# Altium schematic sheet Hall_measurement.SchDoc
size A2
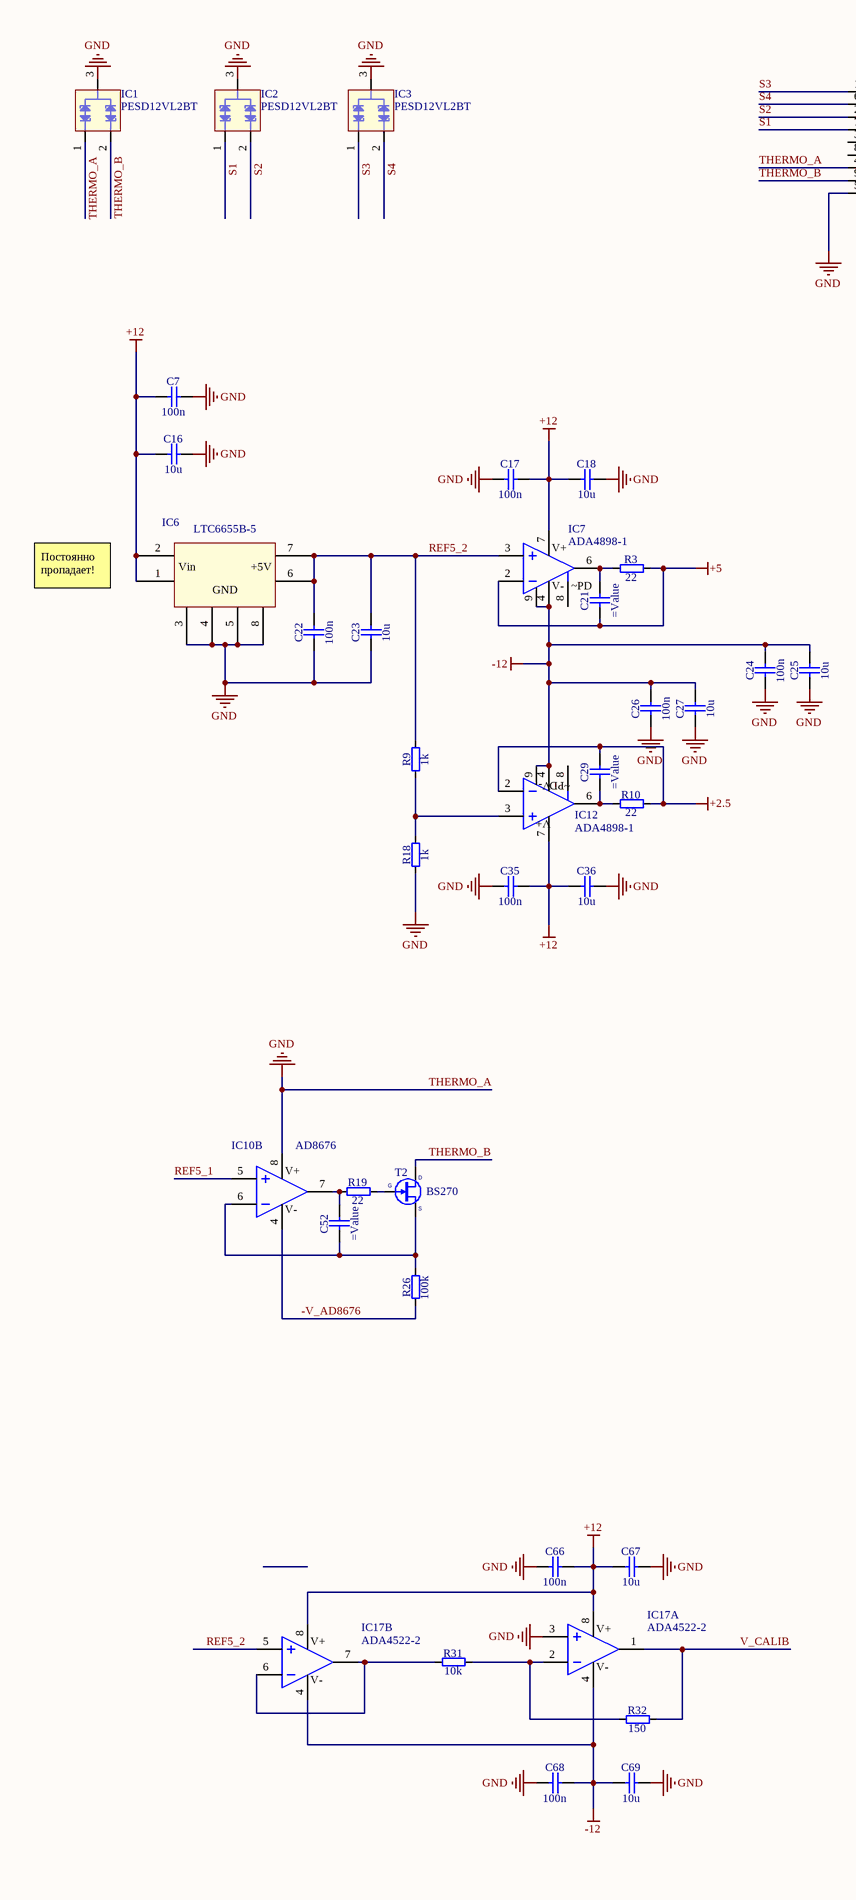
[diagram p0: Hall_measurement.SchDoc, left]
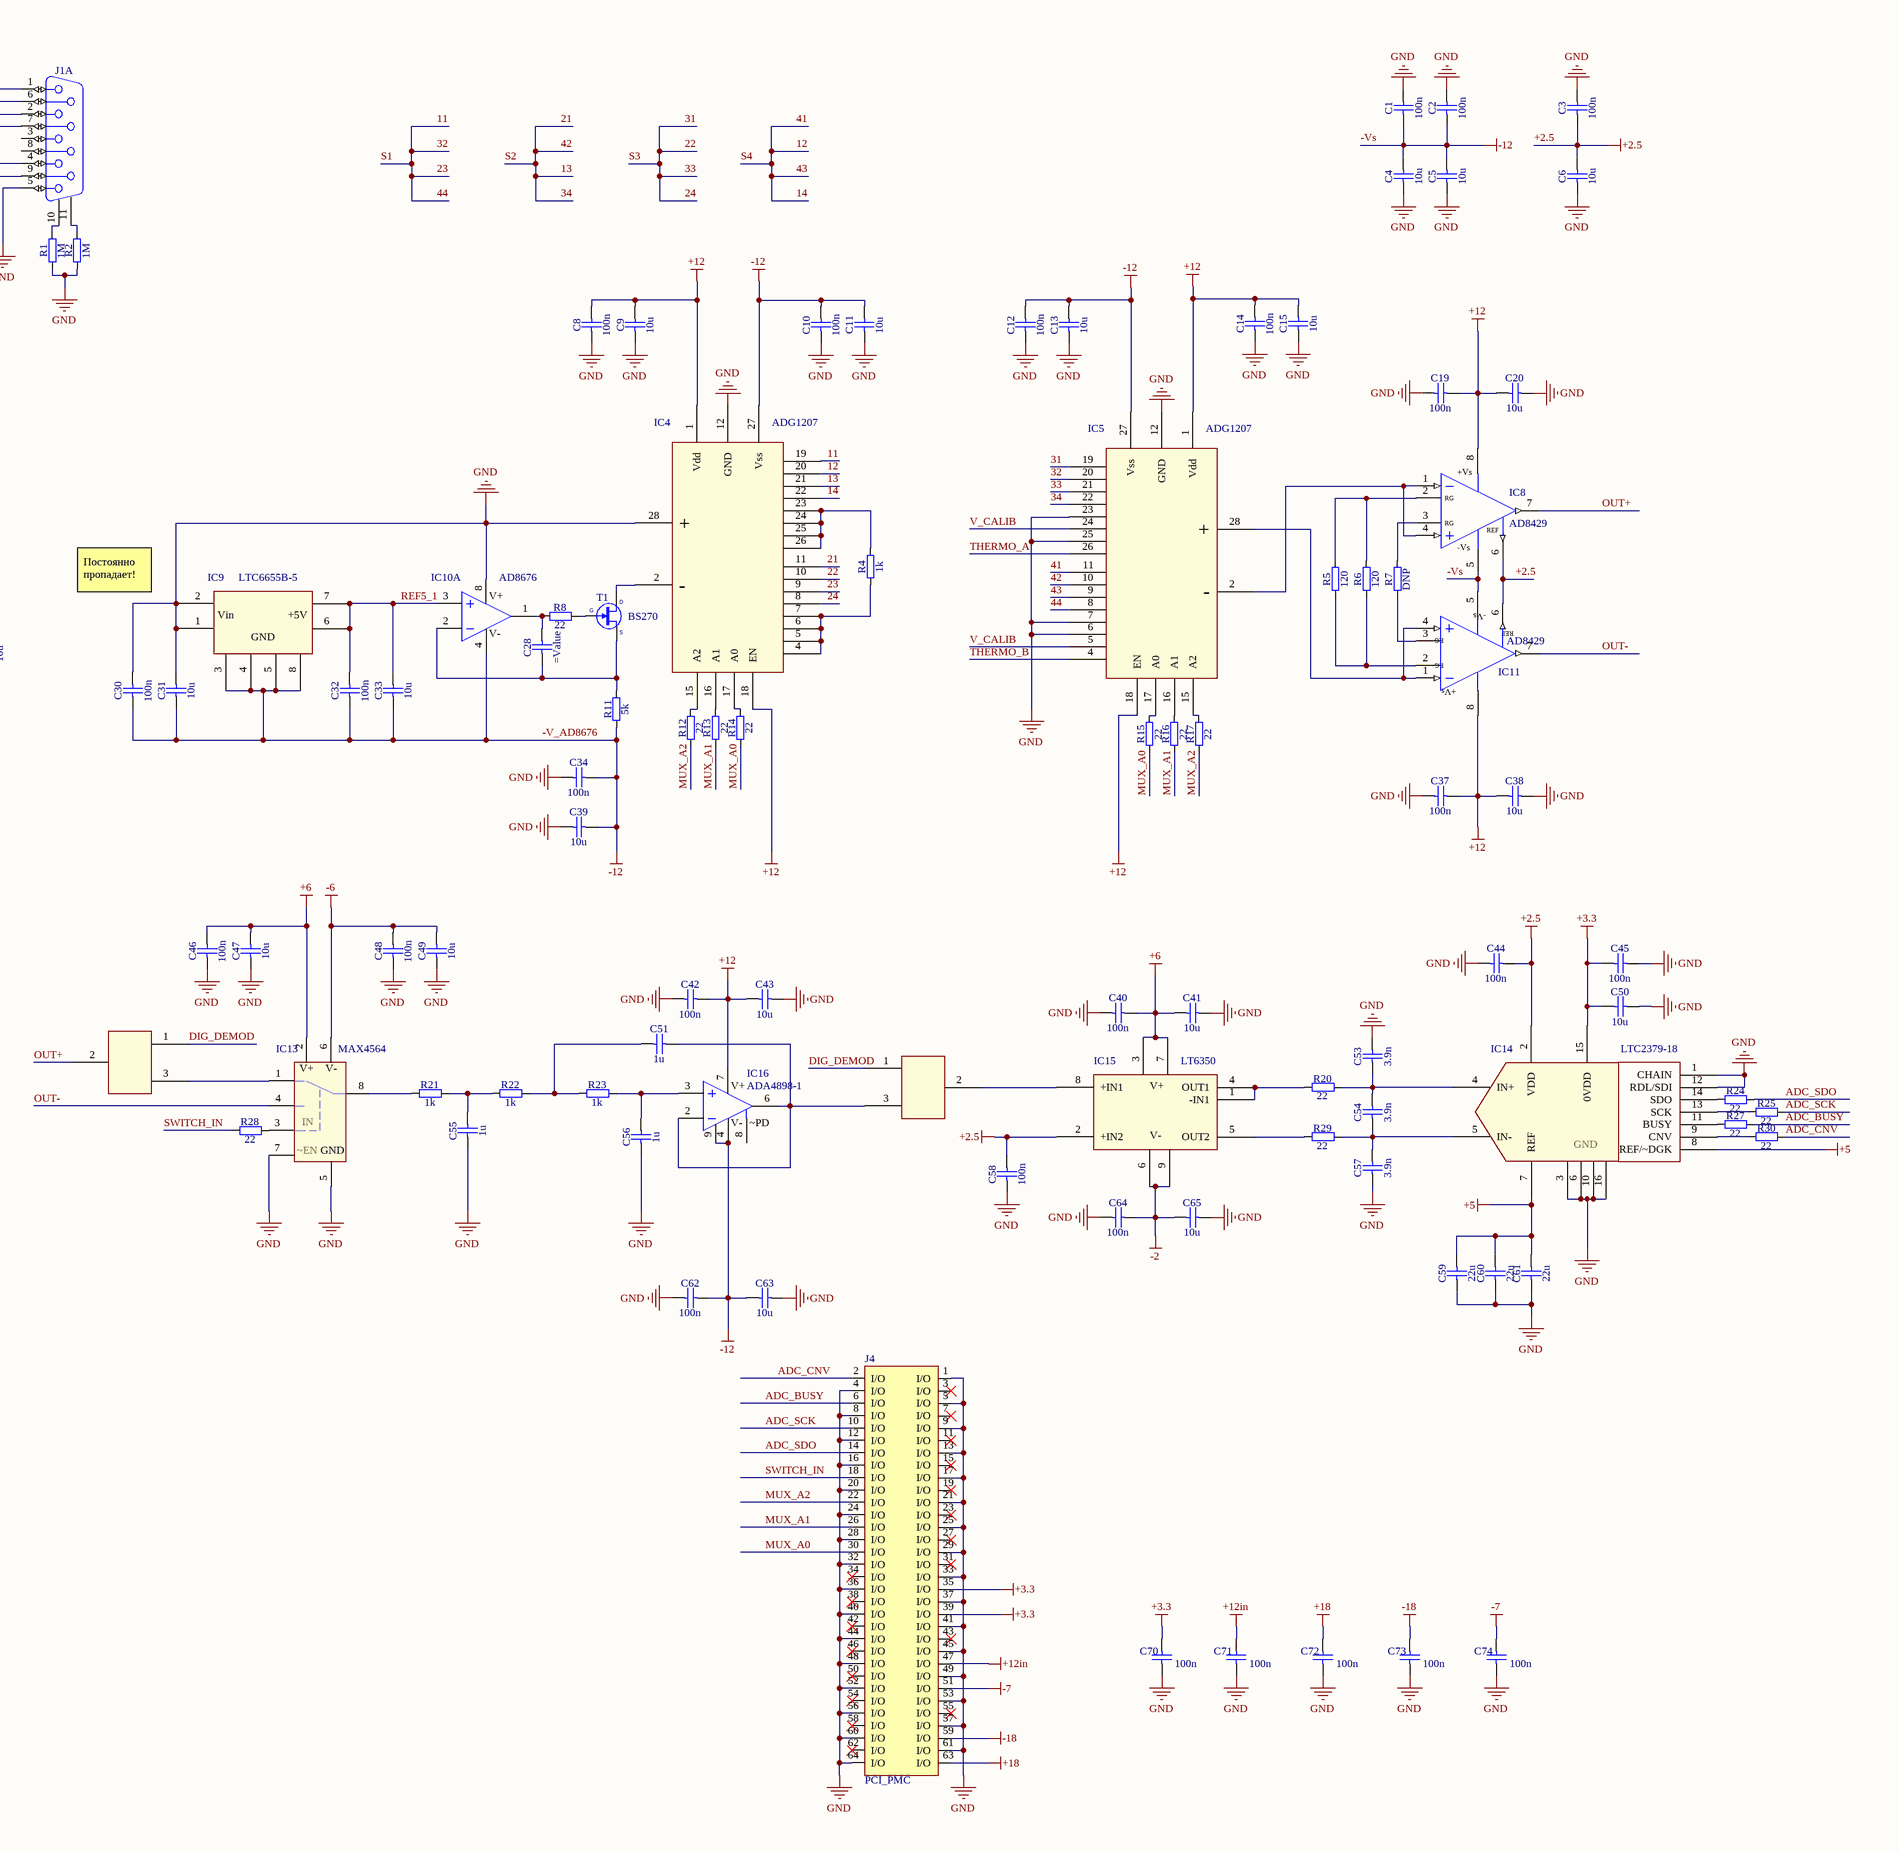
[diagram p1: Hall_measurement.SchDoc, right]

## Parts
C1  100n  [0603]
C2  100n  [0603]
C3  100n  [0603]
C4  10u  [0603]
C5  10u  [0603]
C6  10u  [0603]
C7  100n  [0603]
C8  100n  [0603]
C9  10u  [0603]
C10  100n  [0603]
C11  10u  [0603]
C12  100n  [0603]
C13  10u  [0603]
C14  100n  [0603]
C15  10u  [0603]
C16  10u  [0603]
C17  100n  [0603]
C18  10u  [0603]
C19  100n  [0603]
C20  10u  [0603]
C21  (no value)  [0603]
C22  100n  [0603]
C23  10u  [0603]
C24  100n  [0603]
C25  10u  [0603]
C26  100n  [0603]
C27  10u  [0603]
C28  (no value)  [0603]
C29  (no value)  [0603]
C30  100n  [0603]
C31  10u  [0603]
C32  100n  [0603]
C33  10u  [0603]
C34  100n  [0603]
C35  100n  [0603]
C36  10u  [0603]
C37  100n  [0603]
C38  10u  [0603]
C39  10u  [0603]
C40  100n  [0603]
C41  10u  [0603]
C42  100n  [0603]
C43  10u  [0603]
C44  100n  [0603]
C45  100n  [0603]
C46  100n  [0603]
C47  10u  [0603]
C48  100n  [0603]
C49  10u  [0603]
C50  10u  [0603]
C51  1u  [CAPR500-450X730X950]
C52  (no value)  [0603]
C53  3.9n  [0805]
C54  3.9n  [0805]
C55  1u  [CAPR500-450X730X950]
C56  1u  [CAPR500-450X730X950]
C57  3.9n  [0805]
C58  100n  [0603]
C59  22u  [0603]
C60  22u  [0603]
C61  22u  [0603]
C62  100n  [0603]
C63  10u  [0603]
C64  100n  [0603]
C65  10u  [0603]
C66  100n  [0603]
C67  10u  [0603]
C68  100n  [0603]
C69  10u  [0603]
C70  100n  [0603]
C71  100n  [0603]
C72  100n  [0603]
C73  100n  [0603]
C74  100n  [0603]
IC1  PESD12VL2BT  [SOT95P280X115-3N]
IC2  PESD12VL2BT  [SOT95P280X115-3N]
IC3  PESD12VL2BT  [SOT95P280X115-3N]
IC4  ADG1207  [SOP65P640X120-28N]
IC5  ADG1207  [SOP65P640X120-28N]
IC6  LTC6655B-5  [SOP65P488X110-8N]
IC7  ADA4898-1  [SOIC127P600X175-9N-S229]
IC8  AD8429  [SOIC127P600X175-8N]
IC9  LTC6655B-5  [SOP65P488X110-8N]
IC10  AD8676  [SOIC127P600X175-8N]  (parts A,B of 2)
IC11  AD8429  [SOIC127P600X175-8N]
IC12  ADA4898-1  [SOIC127P600X175-9N-S229]
IC13  MAX4564  [SOT65P280X100-8N]
IC14  LTC2379-18  [SOP50P490X110-16N]
IC15  LT6350  [SON50P300X300X80-9N-R175X248]
IC16  ADA4898-1  [SOIC127P600X175-9N-S229]
IC17  ADA4522-2  [SOIC127P600X175-8N]  (parts A,B of 2)
J1  (no value)  [TYCO_5747844-5]  (part A of 2)
J2  Jumper  [Jumper]  (value not drawn)
J3  Jumper  [Jumper]  (value not drawn)
J4  PCI_PMC  [TYCO_120527-1]
R1  1M  [0603]
R2  1M  [0603]
R3  22  [0603]
R4  1k  [0603]
R5  120  [0805]
R6  120  [0805]
R7  DNP  [0805]
R8  22  [0603]
R9  1k  [0805]
R10  22  [0603]
R11  5k  [1206]
R12  22  [0603]
R13  22  [0603]
R14  22  [0603]
R15  22  [0603]
R16  22  [0603]
R17  22  [0603]
R18  1k  [0805]
R19  22  [0603]
R20  22  [0805]
R21  1k  [0805]
R22  1k  [0805]
R23  1k  [0805]
R24  22  [0603]
R25  22  [0603]
R26  100k  [1206]
R27  22  [0603]
R28  22  [0603]
R29  22  [0805]
R30  22  [0603]
R31  10k  [0805]
R32  150  [0805]
T1  BS270  [TO-92AA-P127]
T2  BS270  [TO-92AA-P127]

## Nets
+2.5: C3.1 C6.2 C29.2 C44.2 C58.2 IC8.6(REF) IC11.6(REF) IC12.2(IN-) IC14.2(VDD) IC15.2(+IN2) R10.2
+3.3: C45.1 C50.1 C70.2 IC14.15(0VDD) J4.35(I/O) J4.39(I/O)
+5: C21.1 C59.2 C60.2 C61.2 IC7.2(IN-) IC14.7(REF) IC14.8(REF/~DGK) R3.2
+6: C40.2 C41.1 C46.2 C47.2 IC13.2(V+) IC15.3(V+) IC15.7
+12: C7.1 C8.2 C9.2 C14.2 C15.2 C16.1 C17.2 C18.1 C19.2 C20.1 C35.1 C36.2 C37.2 C38.1 C42.2 C43.1 C66.2 C67.1 IC4.1(Vdd) IC4.18(EN) IC5.1(Vdd) IC5.18(EN) IC6.1 IC6.2 IC7.7(V+) IC8.8(+Vs) IC11.8(+Vs) IC12.7(V+) IC16.7(V+) IC17.8(V+)
+12in: C71.2 J4.47(I/O)
+18: C72.2 J4.63(I/O)
-2: C64.2 C65.1 IC15.6(V-) IC15.9(V-)
-6: C48.2 C49.2 IC13.6(V-)
-7: C74.2 J4.51(I/O)
-18: C73.2 J4.59(I/O)
-V_AD8676: C1.1 C2.1 C4.2 C5.2 C10.2 C11.2 C12.2 C13.2 C24.2 C25.2 C26.2 C27.2 C30.1 C31.1 C32.1 C33.1 C34.2 C39.1 C62.2 C63.1 C68.2 C69.1 IC4.27(Vss) IC5.27(Vss) IC7.4(V-) IC7.9(EXPOSED_PAD) IC8.5(-Vs) IC9.3 IC9.4 IC9.5 IC9.8 IC10.4(V-) IC11.5(-Vs) IC12.4(V-) IC12.9(EXPOSED_PAD) IC16.4(V-) IC16.9(EXPOSED_PAD) IC17.4(V-) R11.1 R26.1  [also labelled -12, -Vs]
THERMO_A: C1.2 C2.2 C3.2 C4.1 C5.1 C6.1 C7.2 C8.1 C9.1 C10.1 C11.1 C12.1 C13.1 C14.1 C15.1 C16.2 C17.1 C18.2 C19.1 C20.2 C22.1 C23.1 C24.1 C25.1 C26.1 C27.1 C30.2 C31.2 C34.1 C35.2 C36.1 C37.1 C38.2 C39.2 C40.1 C41.2 C42.1 C43.2 C44.1 C45.2 C46.1 C47.1 C48.1 C49.1 C50.2 C53.2 C55.1 C56.1 C57.1 C58.1 C59.1 C60.1 C61.1 C62.1 C63.2 C64.1 C65.2 C66.1 C67.2 C68.1 C69.2 C70.1 C71.1 C72.1 C73.1 C74.1 IC1.1(C1) IC1.3(double_cathode) IC2.3(double_cathode) IC3.3(double_cathode) IC4.12(GND) IC4.28(+) IC5.6 IC5.7 IC5.12(GND) IC5.23 IC5.25 IC5.26 IC6.3 IC6.4 IC6.5 IC6.8 IC9.1 IC9.2 IC10.8(V+) IC13.5(GND) IC13.7(~EN) IC14.1(CHAIN) IC14.3 IC14.6 IC14.10 IC14.12(RDL/SDI) IC14.16 IC17.3(+IN_A) J1.4(U4) J1.5(U5) J4.1(I/O) J4.4(I/O) J4.5(I/O) J4.8(I/O) J4.9(I/O) J4.12(I/O) J4.13(I/O) J4.16(I/O) J4.17(I/O) J4.20(I/O) J4.21(I/O) J4.24(I/O) J4.25(I/O) J4.28(I/O) J4.29(I/O) J4.32(I/O) J4.33(I/O) J4.36(I/O) J4.37(I/O) J4.40(I/O) J4.41(I/O) J4.44(I/O) J4.45(I/O) J4.48(I/O) J4.49(I/O) J4.52(I/O) J4.53(I/O) J4.56(I/O) J4.57(I/O) J4.60(I/O) J4.61(I/O) J4.64(I/O) R1.1 R2.1 R18.1  [also labelled GND]
11: IC2.1(C1) IC4.9 IC4.19 IC5.8 IC5.20 J1.7(U7)  [also labelled 23, 32, 44, S1]
12: IC3.2(C2) IC4.20 IC4.22 IC5.9 IC5.11 J1.6(U6)  [also labelled 14, 41, 43, S4]
13: IC2.2(C2) IC4.11 IC4.21 IC5.10 IC5.22 J1.2(U2)  [also labelled 21, 34, 42, S2]
22: IC3.1(C1) IC4.8 IC4.10 IC5.19 IC5.21 J1.1(U1)  [also labelled 24, 31, 33, S3]
ADC_BUSY: J4.6(I/O) R27.2
ADC_CNV: J4.2(I/O) R30.2
ADC_SCK: J4.10(I/O) R25.2
ADC_SDO: J4.14(I/O) R24.2
DIG_DEMOD: J2.1 J3.1
MUX_A0: J4.30(I/O) R14.1 R15.1
MUX_A1: J4.26(I/O) R13.1 R16.1
MUX_A2: J4.22(I/O) R12.1 R17.1
OUT+: IC8.7(Vout) J2.2
OUT-: IC11.7(Vout) IC13.4(NO)
REF5_1: C32.2 C33.2 IC9.6 IC9.7 IC10.3(+IN_A) IC10.5(+IN_B)
REF5_2: C22.2 C23.2 IC6.6 IC6.7 IC7.3(IN+) IC17.5(+IN_B) R9.2
SWITCH_IN: J4.18(I/O) R28.1
THERMO_B: IC1.2(C2) IC5.4 J1.9(U9) T2.1(D)
V_CALIB: IC5.5 IC5.24 IC17.1(OUT_A) R32.2
NetC21_2: C21.2 IC7.6(OUT) R3.1
NetC28_1: C28.1 IC10.2(-IN_A) R11.2 T1.3(S)
NetC28_2: C28.2 IC10.1(OUT_A) R8.1
NetC29_1: C29.1 IC12.6(OUT) R10.1
NetC51_1: C51.1 R22.2 R23.1
NetC51_2: C51.2 IC16.2(IN-) IC16.6(OUT) J3.3
NetC52_1: C52.1 IC10.6(-IN_B) R26.2 T2.3(S)
NetC52_2: C52.2 IC10.7(OUT_B) R19.1
NetC53_1: C53.1 C54.2 IC14.4(IN+) R20.2
NetC54_1: C54.1 C57.2 IC14.5(IN-) R29.2
NetC55_2: C55.2 R21.2 R22.1
NetC56_2: C56.2 IC16.3(IN+) R23.2
NetIC4_2: IC4.2(-) T1.1(D)
NetIC4_4: IC4.4 IC4.5 IC4.6 IC4.7 R4.1
NetIC4_15: IC4.15(A2) R12.2
NetIC4_16: IC4.16(A1) R13.2
NetIC4_17: IC4.17(A0) R14.2
NetIC4_23: IC4.23 IC4.24 IC4.25 IC4.26 R4.2
NetIC5_2: IC5.2(-) IC8.1(-IN) IC8.4(+IN)
NetIC5_15: IC5.15(A2) R17.2
NetIC5_16: IC5.16(A1) R16.2
NetIC5_17: IC5.17(A0) R15.2
NetIC5_28: IC5.28(+) IC11.1(-IN) IC11.4(+IN)
NetIC8_2: IC8.2(RG) R5.2 R6.2
NetIC8_3: IC8.3(RG) R7.2
NetIC11_2: IC11.2(RG) R5.1 R6.1
NetIC11_3: IC11.3(RG) R7.1
NetIC12_3: IC12.3(IN+) R9.1 R18.2
NetIC13_1: IC13.1(NC) J2.3
NetIC13_3: IC13.3(IN) R28.2
NetIC13_8: IC13.8(COM) R21.1
NetIC14_9: IC14.9(CNV) R30.1
NetIC14_11: IC14.11(BUSY) R27.1
NetIC14_13: IC14.13(SCK) R25.1
NetIC14_14: IC14.14(SDO) R24.1
NetIC15_1: IC15.1(-IN1) IC15.4(OUT1) R20.1
NetIC15_5: IC15.5(OUT2) R29.1
NetIC15_8: IC15.8(+IN1) J3.2
NetIC17_2: IC17.2(-IN_A) R31.2 R32.1
NetIC17_6: IC17.6(-IN_B) IC17.7(OUT_B) R31.1
NetJ1_10: J1.10 R1.2
NetJ1_11: J1.11 R2.2
NetR8_2: R8.2 T1.2(G)
NetR19_2: R19.2 T2.2(G)

Not connected (* = marked no-connect by the designer): IC7 8(~PD); IC12 8(~PD); IC16 8(~PD); J1 3(U3) 8(U8); J4 3(I/O)* 7(I/O)* 11(I/O)* 15(I/O)* 19(I/O)* 23(I/O)* 27(I/O)* 31(I/O)* 34(I/O)* 38(I/O)* 42(I/O)* 43(I/O)* 46(I/O)* 50(I/O)* 54(I/O)* 55(I/O)* 58(I/O)* 62(I/O)*

## Notes on the sheet
- Постоянно пропадает!
- (in symbol LTC2379-18) GND
- (in symbol LTC6655B-5) Vin; +5V; GND

## Library data of the parts
C1-C50 C52-C54 C57-C74 = Capacitor
C51 C55 C56 = Capacitor 4.5mm x 7.3mm
IC4 IC5 = ADG1207: 8-channel multiplexer
IC6 IC9 = LTC6655B-5: Reference, 5 V
IC7 IC12 IC16 = ADA4898-1: Op amp
IC8 IC11 = AD8429: 1 nV/sqrt Hz Low Noise Instrumentation Amplifier
IC10 = AD8676: Dual Op Amp
IC13 = MAX4564: Switch
IC14 = LTC2379-18: ADC
IC15 = LT6350: ADC driver
IC17 = ADA4522-2: Dual Op Amp
J1 = Connector D-sub 2x9 Female
J4 = PCI_PMC: PCI Mezzanine Connector; IEEE 1386 Mezzanine board; Manufactuer: TE Connectivity; PartField: 120527-1; SolderOption: 2; Pkg: PMC Male (IEEE 1386); Value: PCI_PMC; Vendor: TE Connectivity
R1-R32 = Resistor
T1 T2 = Transistor